# EAGLE design Qwiic_Alphanumeric_Display (EAGLE 9.4.2)
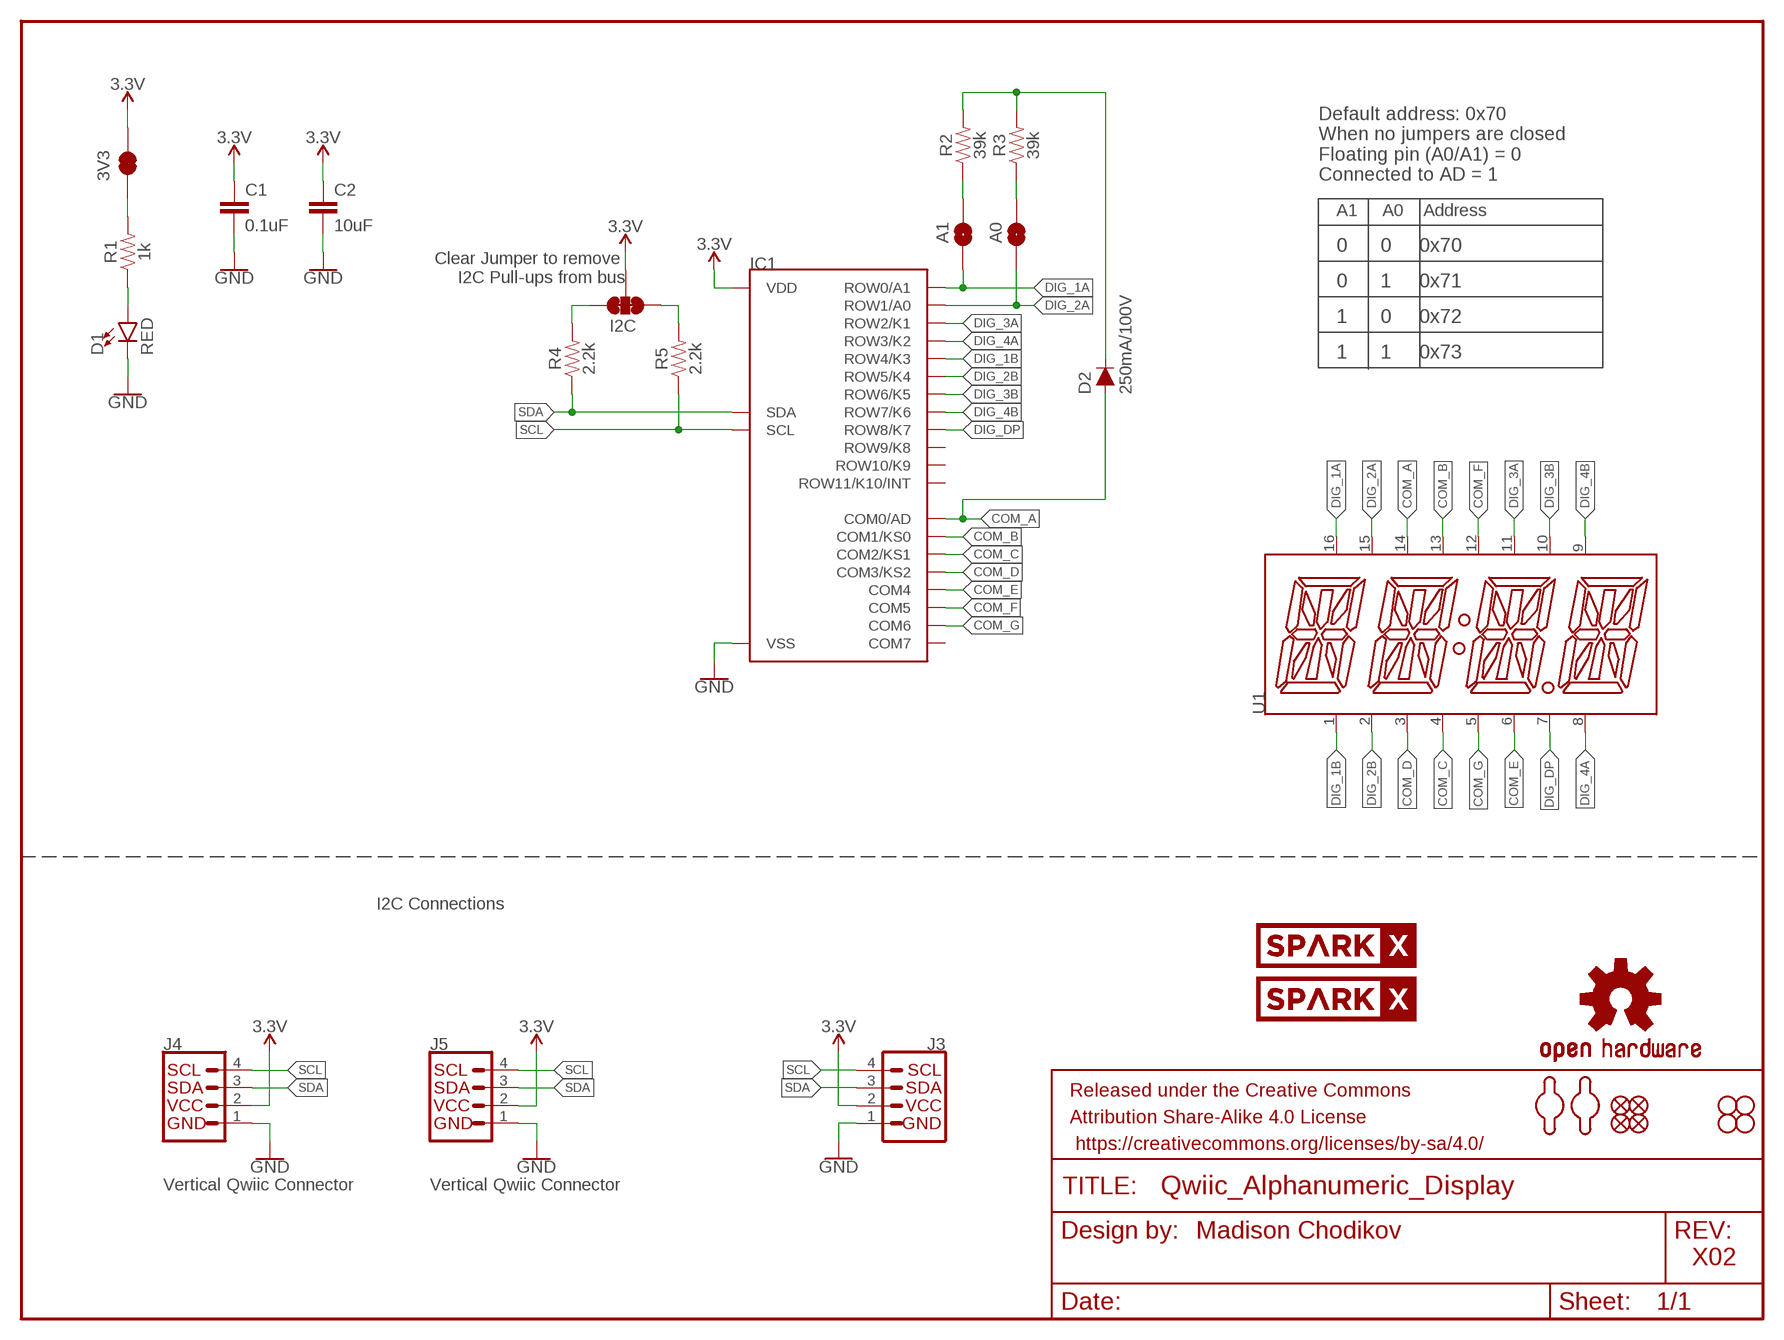
[diagram p0: schematic, sheet 1]

## Parts
3V3  JUMPER-SMT_2_NC_TRACE_SILK  [SMT-JUMPER_2_NC_TRACE_SILK]
A0  JUMPER-SMT_2_NO_SILK  [SMT-JUMPER_2_NO_SILK]
A1  JUMPER-SMT_2_NO_SILK  [SMT-JUMPER_2_NO_SILK]
C1  0.1uF  0.1UF-0603-25V-5%  [0603]
C2  10uF  10UF-0603-6.3V-20%  [0603]
D1  RED  LED-RED0603  [LED-0603]
D2  250mA/100V  DIODE-BAS16J  [SOD-323]
FD1  FIDUCIAL1X2  [FIDUCIAL-1X2]
FD2  FIDUCIAL1X2  [FIDUCIAL-1X2]
FD3  FIDUCIAL1X2  [FIDUCIAL-1X2]
FD4  FIDUCIAL1X2  [FIDUCIAL-1X2]
FRAME1  FRAME-LETTER  [CREATIVE_COMMONS]
H1  STAND-OFF  [STAND-OFF]
H2  STAND-OFF  [STAND-OFF]
H3  STAND-OFF  [STAND-OFF]
H4  STAND-OFF  [STAND-OFF]
I2C  JUMPER-SMT_3_2-NC_TRACE_SILK  [SMT-JUMPER_3_2-NC_TRACE_SILK]
IC1  HT16K33  [HT16K33]
J3  I2C_STANDARD_NO_SILK  [1X04_NO_SILK]
J4  Vertical Qwiic Connector  QWIIC_CONNECTOR  [JST04_1MM_VERT]
J5  Vertical Qwiic Connector  QWIIC_CONNECTOR  [JST04_1MM_VERT]
LOGO1  OSHW-LOGOMINI  [OSHW-LOGO-MINI]
R1  1k  1KOHM-0603-1/10W-1%  [0603]
R2  39k  39KOHM-0603-1/10W-1%  [0603]
R3  39k  39KOHM-0603-1/10W-1%  [0603]
R4  2.2k  2.2KOHM-0603-1/10W-1%  [0603]
R5  2.2k  2.2KOHM-0603-1/10W-1%  [0603]
U1  SILSMART_DISPLAY  [SILSMART_DISPLAY]
U$7  SPARKX-LOGO4  [SPARKX-MEDIUM]
U$8  SPARKX-LOGO4  [SPARKX-MEDIUM]
U$18  MOUNTING_HOLE_M2-0.4X6  [MOUNTING_HOLE_M2-0.4X6]
U$19  MOUNTING_HOLE_M2-0.4X6  [MOUNTING_HOLE_M2-0.4X6]

## Nets
3.3V: 3V3.2 C1.1 C2.1 I2C.2 IC1.24(VDD) J3.2 J4.2 J5.2
COM_A: D2.A IC1.2(COM0/AD) U1.14(COM_A)
COM_B: IC1.3(COM1/KS0) U1.13(COM_B)
COM_C: IC1.4(COM2/KS1) U1.4(COM_C)
COM_D: IC1.5(COM3/KS2) U1.3(COM_D)
COM_E: IC1.6(COM4) U1.6(COM_E)
COM_F: IC1.7(COM5) U1.12(COM_F)
COM_G: IC1.8(COM6) U1.5(COM_G1)
DIG_1A: A1.1 IC1.21(ROW0/A1) U1.16(DIG_1A)
DIG_1B: IC1.17(ROW4/K3) U1.1(DIG_1B)
DIG_2A: A0.1 IC1.20(ROW1/A0) U1.15(DIG_2A)
DIG_2B: IC1.16(ROW5/K4) U1.2(DIG_2B)
DIG_3A: IC1.19(ROW2/K1) U1.11(DIG_3A)
DIG_3B: IC1.15(ROW6/K5) U1.10(DIG_3B)
DIG_4A: IC1.18(ROW3/K2) U1.8(DIG_4A)
DIG_4B: IC1.14(ROW7/K6) U1.9(DIG_4B)
DIG_DP: IC1.13(ROW8/K7) U1.7(DIG_DP)
GND: C1.2 C2.2 D1.C IC1.1(VSS) J3.1 J4.1 J5.1
N$1: D1.A R1.1
N$2: A1.2 R2.1
N$3: A0.2 R3.1
N$4: I2C.1 R5.2
N$5: I2C.3 R4.2
N$6: D2.C R2.2 R3.2
N$7: 3V3.1 R1.2
SCL: IC1.22(SCL) J3.4 J4.4 J5.4 R5.1
SDA: IC1.23(SDA) J3.3 J4.3 J5.3 R4.1
Unconnected: IC1.9(COM7) IC1.10(ROW11/K10/INT) IC1.11(ROW10/K9) IC1.12(ROW9/K8)

## Notes on the sheet
- Default address: 0x70
  When no jumpers are closed
  Floating pin (A0/A1) = 0
  Connected to AD = 1
- A1     A0    Address
- Clear Jumper to remove 
  I2C Pull-ups from bus
- 0      0     0x70
- 0      1     0x71
- 1      0     0x72
- 1      1     0x73
- I2C Connections
- Madison Chodikov
- X02

## Library data of the parts
3V3 = SparkFun-Jumpers:JUMPER-SMT_2_NC_TRACE: Normally closed trace jumper This jumper has a trace between two pads so it's normally closed (NC). Use a razor knife to open the connection. For best results follow the IPC guidelines for cutting traces: Cutout at least 0.063 mm (0.005 in). Remove all loose material to clean up the cut area. Seal the cut with an approved epoxy. Reapply solder to reclose the connection.
A0 A1 = SparkFun-Jumpers:JUMPER-SMT_2_NO: Normally open jumper This jumper has two pads in close proximity to each other. Apply solder to close the connection. Round pads are easier to solder for beginners, but are a lot larger. SparkFun Product that uses the round pads: SparkFun EL Sequencer <https://www.sparkfun.com/products/12781>
C1 = SparkFun-Capacitors:0.1UF: 0.1µF ceramic capacitors A capacitor is a passive two-terminal electrical component used to store electrical energy temporarily in an electric field.; PROD_ID: CAP-08604
C2 = SparkFun-Capacitors:10UF: 10.0µF ceramic capacitors A capacitor is a passive two-terminal electrical component used to store electrical energy temporarily in an electric field.; PROD_ID: CAP-11015
D1 = SparkFun-LED:LED-RED: Red SMD LED Used in manufacturing of most products at SparkFun Packages: 0603 - SMD 0603 package [Product Link] <http://docs.avagotech.com/docs/AV02-0551EN> 0603 SMART - SMD 0603 SMART package ( more efficient and expensive)[Product Link] <http://www.osram-os.com/Graphics/XPic2/00077099_0.pdf> 1206 - SMD1206 package [Product Link] <https://www.sparkfun.com/datasheets/DevTools/LilyPad/Q150OVS4.pdff> SparkFun Products: Pro Mini 328 -5V <https://www.sparkfun.com/products/821> RedBoard <https://www.sparkfun.com/products/12757> IOIO-OTG <https://www.sparkfun.com/products/13613>; PROD_ID: DIO-00819
D2 = SparkFun-DiscreteSemi:DIODE: Diode These are standard reverse protection diodes and small signal diodes. SparkFun Products: SparkFun SparkPunk Sound Kit <https://www.sparkfun.com/products/11177> SparkFun ESP8266 Thing <https://www.sparkfun.com/products/13231>; PROD_ID: DIO-09646
FD1-FD4 = SparkFun-Aesthetics:FIDUCIAL: Fiducial Alignment Points Point-of-reference for pick-and-place machines and other optical instruments.
FRAME1 = SparkFun-Aesthetics:FRAME-LETTER: Schematic Frame - Letter Standard 8.5x11 US Letter frame
H1-H4 = SparkFun-Hardware:STAND-OFF: Stand Off Drill holes for mechanically mounting via screws, standoffs, etc. Note: Use the keepout ring to avoid running the screw head into surrounding components. Variant Overviews STAND-OFF - Mechanical footprint for a #4 phillips button head screw. STAND-OFF-TIGHT - Mechanical footprint for a #4 phillips button head screw, Example SparkFun Products Screw - Phillips Head (1/4", 4-40, 10 pack) <https://www.sparkfun.com/products/10453> (PRT-10453) Screw - Phillips Head (1/2", 4-40, 10 pack) <https://www.sparkfun.com/products/10452> (PRT-10452) Screw - Phillips Head (3/4", 4-40, 10 pack) <https://www.sparkfun.com/products/10451> (PRT-10451) Screw - Phillips Head (1", 4-40, 10 pack) <https://www.sparkfun.com/products/10450> (PRT-10450)
I2C = SparkFun-Jumpers:JUMPER-SMT_3_2-NC_TRACE: Normally closed trace jumper (2 of 2 connections) This jumper has a trace between all three pads so they are normally closed (NC). Use a razor knife to open the connection(s). For best results follow the IPC guidelines for cutting traces: Cutout at least 0.063 mm (0.005 in). Remove all loose material to clean up the cut area. Seal the cut with an approved epoxy. Reapply solder to reclose the connection(s).
IC1 = Alphanumeric_Display_Library:HT16K33: HT16K33 24 SOP-A : RAM Mapping 16x8 LED Controller Driver with Keyscan; PROD_ID: IC-14891
J3 = SparkFun-Connectors:I2C_STANDARD: SparkFun I2C Standard Pinout Header SparkFun has standardized on a pinout for all I2C based sensor breakouts. This pinout allows I2C boards to be plugged directly into the headers on Arduino Uno compatible boards, and to be daisy chained easily. Example SparkFun Products: SparkFun Atmospheric Sensor Breakout - BME280 <https://www.sparkfun.com/products/13676> SparkFun Altitude/Pressure Sensor Breakout - MPL3115A2 <https://www.sparkfun.com/products/11084> SparkFun TOF Range Finder Sensor - VL6180 <https://www.sparkfun.com/products/12785>
J4 J5 = SparkFun-Connectors:QWIIC_CONNECTOR: SparkFun I2C Standard Qwiic Connector An SMD 1mm pitch JST connector makes it easy and quick (get it? Qwiic?) to connect I2C devices to each other. The Qwiic system <http://www.sparkfun.com/qwiic> enables fast and solderless connection between popular platforms and various sensors and actuators. We carry 200mm <https://www.sparkfun.com/products/14204>, 100mm <https://www.sparkfun.com/products/14205>, 50mm <https://www.sparkfun.com/products/14206>, and breadboard friendly <https://www.sparkfun.com/products/14207> Qwiic cables. We also offer 10 pcs strips <https://www.sparkfun.com/products/14323> the SMD connectors.; PROD_ID: CONN-14483
LOGO1 = SparkFun-Aesthetics:OSHW-LOGO: Open-Source Hardware (OSHW) Logo This logo indicates the piece of hardware it is found on incorporates a OSHW license and/or adheres to the definition of open source hardware found here: http://freedomdefined.org/OSHW
R1 = SparkFun-Resistors:1KOHM: 1kΩ resistor A resistor is a passive two-terminal electrical component that implements electrical resistance as a circuit element. Resistors act to reduce current flow, and, at the same time, act to lower voltage levels within circuits. - Wikipedia; PROD_ID: RES-07856
R2 R3 = SparkFun-Resistors:39KOHM: 39kΩ resistor A resistor is a passive two-terminal electrical component that implements electrical resistance as a circuit element. Resistors act to reduce current flow, and, at the same time, act to lower voltage levels within circuits. - Wikipedia; PROD_ID: RES-12377
R4 R5 = SparkFun-Resistors:2.2KOHM: 2.2kΩ resistor A resistor is a passive two-terminal electrical component that implements electrical resistance as a circuit element. Resistors act to reduce current flow, and, at the same time, act to lower voltage levels within circuits. - Wikipedia; PROD_ID: RES-08272
U1 = Alphanumeric_Display_Library:SILSMART_DISPLAY: 14-Segment Alphanumeric LED Display from Silsmart Optoelectronics; PROD_ID: COMP-14892
U$7 U$8 = SparkX:SPARKX-LOGO
U$18 U$19 = Alphanumeric_Display_Library:MOUNTING_HOLE_M2-0.4X6

## Board
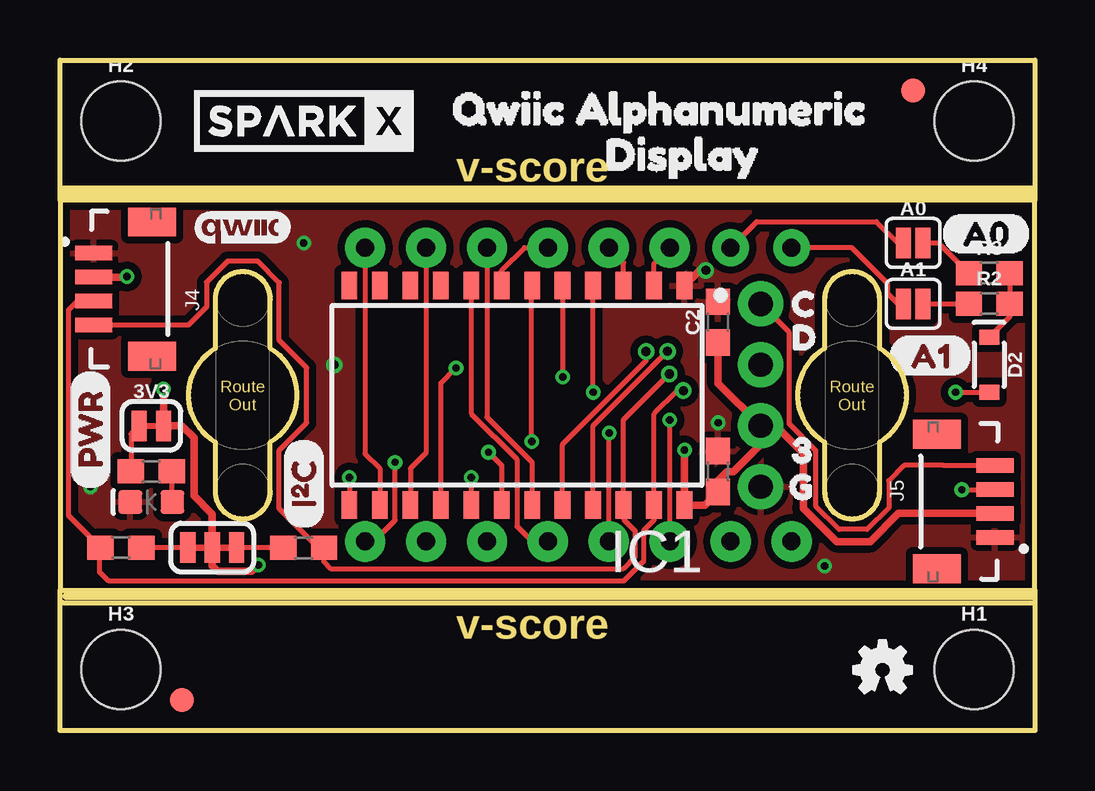
[diagram p1: board, top side]
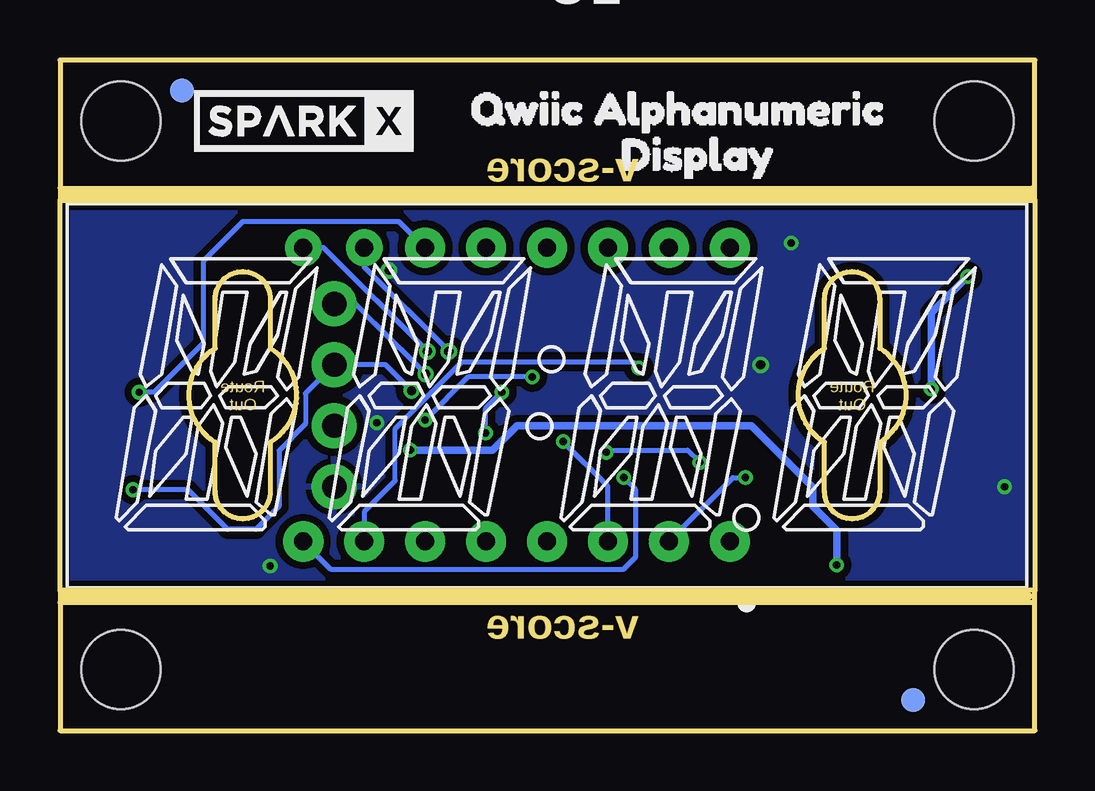
[diagram p2: board, bottom side, seen from below]

Size 40.64 x 27.94 mm. Coordinates in mm from the lower left corner, seen from the top.
Outline: 0,5.84 40.64,5.84
Outline: 40.64,5.84 40.64,22.1
Outline: 40.64,22.1 0,22.1
Outline: 0,22.1 0,5.84
Outline: 0,22.1 0,27.94 40.64,27.94 40.64,22.1
Outline: 40.64,5.84 40.64,0 0,0 0,5.84
Outline: 40.64,22.61 0.13,22.61
Outline: 0.13,5.33 40.64,5.33
Copper layers (1*16): Top 0.035mm / dielectric 1.5mm / Bottom 0.035mm
Design rules "SparkFun-2-layer-PCBWay-LIMIT": minimum track width 6mil, minimum drill 0.3mm, track to track 6mil, track to pad 6mil, pad to pad 6mil, via to via 6mil, smd to smd 6mil, copper to edge 6mil, drill to drill 6mil, minimum pad ring 6mil, minimum via ring 6mil, stop-mask expansion 4mil, vias tented up to drill 25mil, thermal gap 10mil
Milling: 2 lines

### Footprints (pad centres in the part's own frame; a part is rotated, then mirrored left to right if it is on the bottom)
SMT-JUMPER_2_NC_TRACE_SILK = smd 0.635 x 1.27: 1 -0.508,0; 2 0.508,0
SMT-JUMPER_2_NO_SILK = smd 0.635 x 1.27: 1 -0.406,0; 2 0.406,0
0603 = smd 1.1 x 1: 1 -0.85,0; 2 0.85,0
LED-0603 = smd 1 x 1: A -0.877,0; C 0.877,0
SOD-323 = smd 0.63 x 0.83: A 1.15,0; C -1.15,0
FIDUCIAL-1X2 = smd 1 x 1: 1 0,0
STAND-OFF = hole 3.302: 0,0
SMT-JUMPER_3_2-NC_TRACE_SILK = smd 0.635 x 1.27: 1 -1.016,0; 2 0,0; 3 1.016,0
HT16K33 = smd 0.66 x 1.143: 1 -6.985,-4.572; 2 -5.715,-4.572; 3 -4.445,-4.572; 4 -3.175,-4.572; 5 -1.905,-4.572; 6 -0.635,-4.572; 7 0.635,-4.572; 8 1.905,-4.572; 9 3.175,-4.572; 10 4.445,-4.572; 11 5.715,-4.572; 12 6.985,-4.572; 13 6.985,4.572; 14 5.715,4.572; 15 4.445,4.572; 16 3.175,4.572; 17 1.905,4.572; 18 0.635,4.572; 19 -0.635,4.572; 20 -1.905,4.572; 21 -3.175,4.572; 22 -4.445,4.572; 23 -5.715,4.572; 24 -6.985,4.572
1X04_NO_SILK = drill 1.016 pad 1.88: 1 0,0; 2 2.54,0; 3 5.08,0; 4 7.62,0
JST04_1MM_VERT = smd 0.6 x 1.55: 1 -1.478,0.775; 2 -0.478,0.775; 3 0.522,0.775; 4 1.522,0.775 | smd 1.2 x 2: NC1 -2.778,3.2; NC2 2.822,3.2
SILSMART_DISPLAY = drill 0.75 pad 1.676: 1 -10.178,-6.092; 2 -7.638,-6.092; 3 -5.098,-6.092; 4 -2.558,-6.092; 5 -0.018,-6.092; 6 2.522,-6.092; 7 5.062,-6.092; 8 7.602,-6.092; 9 7.602,6.148; 10 5.062,6.148; 11 2.522,6.148; 12 -0.018,6.148; 13 -2.558,6.148; 14 -5.098,6.148 | drill 0.75 pad 1.524: 15 -7.638,6.148; 16 -10.178,6.148

### Placement (x,y rotation side)
3V3  3.81,12.7 0 top
A0  35.56,20.32 0 top
A1  35.56,17.78 0 top
C1  27.43,10.79 90 top
C2  27.43,17.02 90 top
D1  3.81,9.53 180 top
D2  38.73,15.24 270 top
FD1  5.08,1.27 0 top
FD2  5.08,1.27 0 bottom
FD3  35.56,26.67 0 top
FD4  35.56,26.67 0 bottom
FRAME1  -1.27,-10.16 0 top  (outside the outline)
H1  38.1,2.54 0 top
H2  2.54,25.4 0 top
H3  2.54,2.54 0 top
H4  38.1,25.4 0 top
I2C  6.35,7.62 180 top
IC1  19.05,13.97 180 top
J3  29.21,10.16 90 top
J4  0.64,18.41 270 top
J5  39.75,9.53 90 top
LOGO1  34.29,2.54 0 top
R1  3.81,10.79 180 top
R2  38.73,17.78 0 top
R3  38.73,19.05 0 top
R4  2.54,7.62 0 top
R5  10.16,7.62 180 top
U1  20.32,13.97 0 bottom
U$1  [32]  29.59,11.68 0 top
U$2  [C0]  29.59,17.78 0 top
U$3  [PWR5]  1.27,10.03 90 top
U$4  [D1]  29.59,16.38 0 top
U$5  [G3]  29.46,10.16 0 top
U$6  [QWIIC_4MM]  7.62,20.96 0 top
U$7  10.16,25.4 0 top
U$8  30.48,25.4 0 bottom
U$10  [I_SUPER2_C-()-04]  10.16,8.38 90 top
U$13  [QWIIC_ALPHANUMERIC0]  24.64,25.91 0 bottom
U$15  [QWIIC_ALPHANUMERIC0]  15.24,25.91 0 top
U$16  [DISPLAY1]  21.59,24 0 top
U$17  [DISPLAY1]  18.41,24 0 bottom
U$18  33.02,13.97 0 top
U$19  7.62,13.97 0 top
U$20  [A00]  36.7,20.7 0 top
U$21  [A11]  34.54,15.62 0 top

### Tracks (layer width: path | path; a pad name or v marks a point on that pad's centre or on a via)
3.3V  (via drill 0.3)
  Top 0.203: 2.76,18.89 v2.79,18.92
  Top 0.305: J3.2 29.84,12.7 30.99,11.56 30.99,9.27 32.38,7.87 33.78,7.87 34.95,9.05 J5.2 | v26.04,11.68 IC1.24 26.89,9.4 C1.1 27.43,10.41 27.81,10.79 28.08,10.79 29.21,11.92 J3.2 | J4.2 2.76,18.89 | v4.32,14.22 3V3.2 5.08,12.7 5.59,12.19 5.59,9.78 6.35,9.02 I2C.2 6.35,6.86 6.58,6.63 8,6.63 v8.27,6.9 | J3.2 27.43,14.48 C2.1
  Bottom 0.305: v26.04,11.68 22.61,11.68 21.59,12.7 11.81,12.7 9.25,10.14 9.25,9.34 8.27,8.35 v8.27,6.9 | v2.79,18.92 4.32,17.4 v4.32,14.22
COM_A  (via drill 0.3)
  Top 0.203: v37.34,14.1 D2.A | IC1.2 24.77,19.46 U1.14
  Bottom 0.203: U1.14 26.51,21.21 33.02,21.21 34.67,19.56 34.67,16.13 36.7,14.1 v37.34,14.1
COM_B
  Top 0.203: IC1.3 23.5,19.5 U1.13
COM_C  (via drill 0.3)
  Top 0.203: v22.23,14.1 IC1.4 | U1.4 22.88,12.38 v22.9,12.4
  Bottom 0.203: v22.9,12.4 22.9,13.42 v22.23,14.1
COM_D  (via drill 0.3)
  Top 0.203: IC1.5 v20.95,14.73 | U1.3 v25.42,12.94
  Bottom 0.203: v20.95,14.73 23.62,14.73 v25.42,12.94
COM_E  (via drill 0.3)
  Top 0.203: v19.66,12.04 19.66,18.52 IC1.6
  Bottom 0.203: U1.6 17.8,10.18 v19.66,12.04
COM_F
  Top 0.203: IC1.7 18.41,19.18 19.36,20.12 U1.12
COM_G
  Top 0.203: IC1.8 17.14,13.21 19.05,11.3 19.05,8.51 19.68,7.88 U1.5
DIG_1A  (via drill 0.38)
  Top 0.203: A1.1 34.92,17.78 34.51,18.2 34.51,18.62 33.01,20.12 U1.16 | IC1.21 22.23,12.7 v25.32,15.8
  Bottom 0.203: v25.32,15.8 29.64,20.12 U1.16
DIG_1B  (via drill 0.3)
  Top 0.203: v17.14,10.54 IC1.17
  Bottom 0.203: U1.1 29.35,6.73 17.14,6.73 16.64,7.24 16.64,10.03 v17.14,10.54
DIG_2A  (via drill 0.38)
  Top 0.203: U1.15 29.05,21.21 34.04,21.21 34.92,20.32 A0.1 | IC1.20 20.95,11.94 24.43,15.41 v24.43,15.79
  Bottom 0.203: v24.43,15.79 27.96,19.32 U1.15
DIG_2B  (via drill 0.3)
  Top 0.203: IC1.16 15.88,14.48 v16.51,15.11
  Bottom 0.203: v16.51,15.11 16.76,15.37 23.88,15.37 26.67,12.57 26.67,10.41 27.94,9.14 27.94,7.9 U1.2
DIG_3A
  Top 0.203: U1.11 17.8,13.06 19.68,11.18 IC1.19
DIG_3B
  Top 0.203: U1.10 15.26,11.58 14.61,10.92 IC1.15
DIG_4A  (via drill 0.3)
  Top 0.203: U1.8 13.09,7.88 13.97,8.76 v13.97,11.18 | v17.87,11.6 18.41,11.05 IC1.18
  Bottom 0.203: v13.97,11.18 14.48,11.68 17.78,11.68 v17.87,11.6
DIG_4B
  Top 0.203: U1.9 12.72,11.54 13.34,10.92 IC1.14
DIG_DP  (via drill 0.3)
  Top 0.203: v12.06,10.54 IC1.13
  Bottom 0.203: U1.7 12.6,10.54 v12.06,10.54
GND  (via drill 0.3, 0.38)
  Top 0.305: IC1.1 26.67,19.18 v26.92,19.18
  other vias: 10.16,20.32 27.43,12.83 1.27,10.16 31.88,6.86 11.43,15.24
  pour Top (isolate 0.305): 0,5.84 0,22.1 40.64,22.1 40.64,5.84
  pour Bottom (isolate 0.305): 0,22.1 40.64,22.1 40.64,5.84 0,5.84
N$1
  Top 0.203: D1.A 4.69,10.77 R1.1
N$2
  Top 0.203: A1.2 R2.1
N$3
  Top 0.203: A0.2 36.62,20.32 R3.1
N$4
  Top 0.203: R5.2 I2C.1
N$5
  Top 0.203: I2C.3 R4.2
N$6
  Top 0.203: R3.2 R2.2 39.59,17.24 D2.C
N$7
  Top 0.203: 3V3.1 2.96,12.36 R1.2
SCL  (via drill 0.38)
  Top 0.203: J3.4 30.4,16.59 30.4,12.78 31.5,11.68 31.5,9.36 32.47,8.38 33.66,8.38 34.54,9.27 34.54,10.41 35.18,11.05 36.83,11.05 J5.4 | v25.4,14.86 23.5,12.95 IC1.22 23.5,8.81 23.97,8.33 23.97,7.24 23.46,6.73 11.3,6.73 11.01,7.02 R5.1 10.76,7.62 9.14,9.23 9.14,11.68 10.29,12.83 10.29,15.11 9.14,16.26 9.14,18.67 8.26,19.56 6.99,19.56 6.11,18.69 6.11,17.65 5.35,16.89 J4.4
  Bottom 0.203: v25.4,14.86 27.5,16.95 28.32,17.78 J3.4
SDA  (via drill 0.3, 0.38)
  Top 0.203: J5.3 38.96,10.03 v37.59,10.03 | J4.3 0.72,17.89 0.36,17.53 0.36,8.95 R4.1 1.65,7.58 1.65,6.6 2.03,6.22 23.5,6.22 24.33,7.05 24.33,8.33 24.77,8.77 IC1.23 24.77,13.2 25.73,14.16 v25.98,14.16
  Bottom 0.203: v37.59,10.03 35.31,10.03 33.66,8.38 32.47,8.38 31.51,9.34 31.51,11.67 30.4,12.78 30.4,14.05 J3.3 27.06,15.24 v25.98,14.16

### Text on the board
Dimension: v-score | v-score
tDocu: Madison Chodikov
_tNames: I2C
_bNames: U1